# Altium schematic sheet 4-storage.SchDoc
size A4
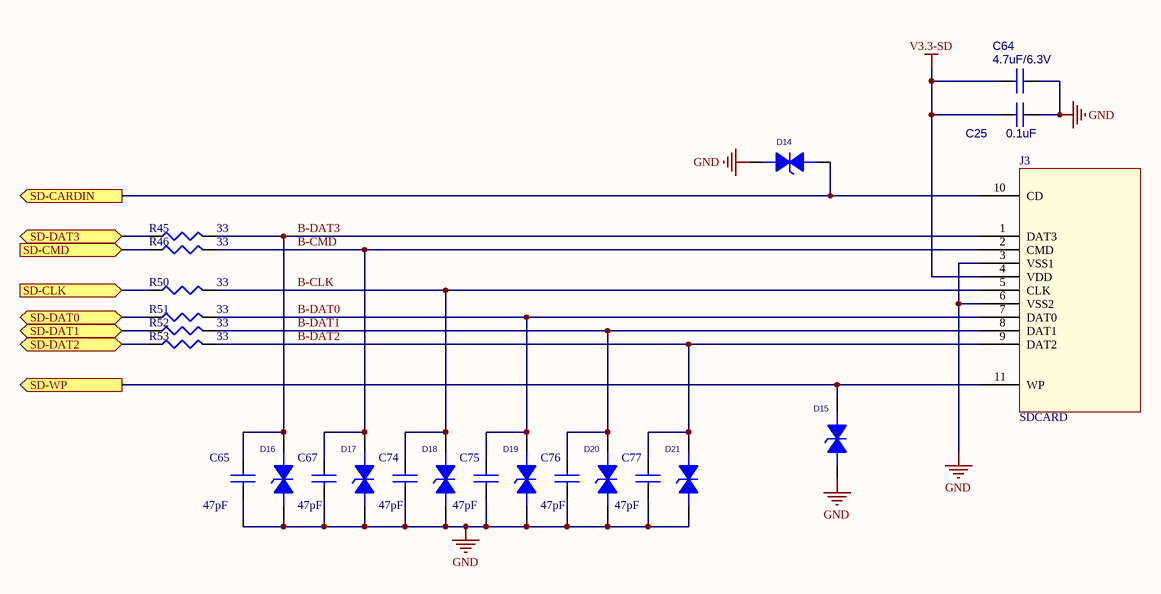
[diagram p0: 4-storage.SchDoc]

## Parts
C25  0.1uF  [0603]
C64  4.7uF/6.3V  [0805]
C65  47pF  [0402]
C67  47pF  [0402]
C74  47pF  [0402]
C75  47pF  [0402]
C76  47pF  [0402]
C77  47pF  [0402]
D14  SMV0402G5R6N121T  [0402]  (value not drawn)
D15  SMV0402G5R6N121T  [0402]  (value not drawn)
D16  SMV0402G5R6N121T  [0402]  (value not drawn)
D17  SMV0402G5R6N121T  [0402]  (value not drawn)
D18  SMV0402G5R6N121T  [0402]  (value not drawn)
D19  SMV0402G5R6N121T  [0402]  (value not drawn)
D20  SMV0402G5R6N121T  [0402]  (value not drawn)
D21  SMV0402G5R6N121T  [0402]  (value not drawn)
J3  SDCARD  [SDCARD]
R45  33  [0603]
R46  33  [0603]
R50  33  [0603]
R51  33  [0603]
R52  33  [0603]
R53  33  [0603]

## Ports
SD-CARDIN (out), SD-CLK (in), SD-CMD (in), SD-DAT0 (bidir), SD-DAT1 (bidir), SD-DAT2 (bidir), SD-DAT3 (bidir), SD-WP (out)

## Nets
GND: C25.1 C64.1 C65.2 C67.2 C74.2 C75.2 C76.2 C77.2 D14.2 D15.1 D16.1 D17.1 D18.1 D19.1 D20.1 D21.1 J3.3(VSS1) J3.6(VSS2)
V3.3-SD: C25.2 C64.2 J3.4(VDD)
B-CLK: C74.1 D18.2 J3.5(CLK) R50.2
B-CMD: C67.1 D17.2 J3.2(CMD) R46.2
B-DAT0: C75.1 D19.2 J3.7(DAT0) R51.2
B-DAT1: C76.1 D20.2 J3.8(DAT1) R52.2
B-DAT2: C77.1 D21.2 J3.9(DAT2) R53.2
B-DAT3: C65.1 D16.2 J3.1(DAT3) R45.2
SD-CARDIN: D14.1 J3.10(CD) ; port SD-CARDIN
SD-CLK: R50.1 ; port SD-CLK
SD-CMD: R46.1 ; port SD-CMD
SD-DAT0: R51.1 ; port SD-DAT0
SD-DAT1: R52.1 ; port SD-DAT1
SD-DAT2: R53.1 ; port SD-DAT2
SD-DAT3: R45.1 ; port SD-DAT3
SD-WP: D15.2 J3.11(WP) ; port SD-WP

## Library data of the parts
C25 C64 C65 C67 C74-C77 = CAP NP_Dup2
D14-D21 = PESD
R45 R46 R50-R53 = CR16-1003FM